# Altium schematic sheet Quilles.SchDoc
size A2
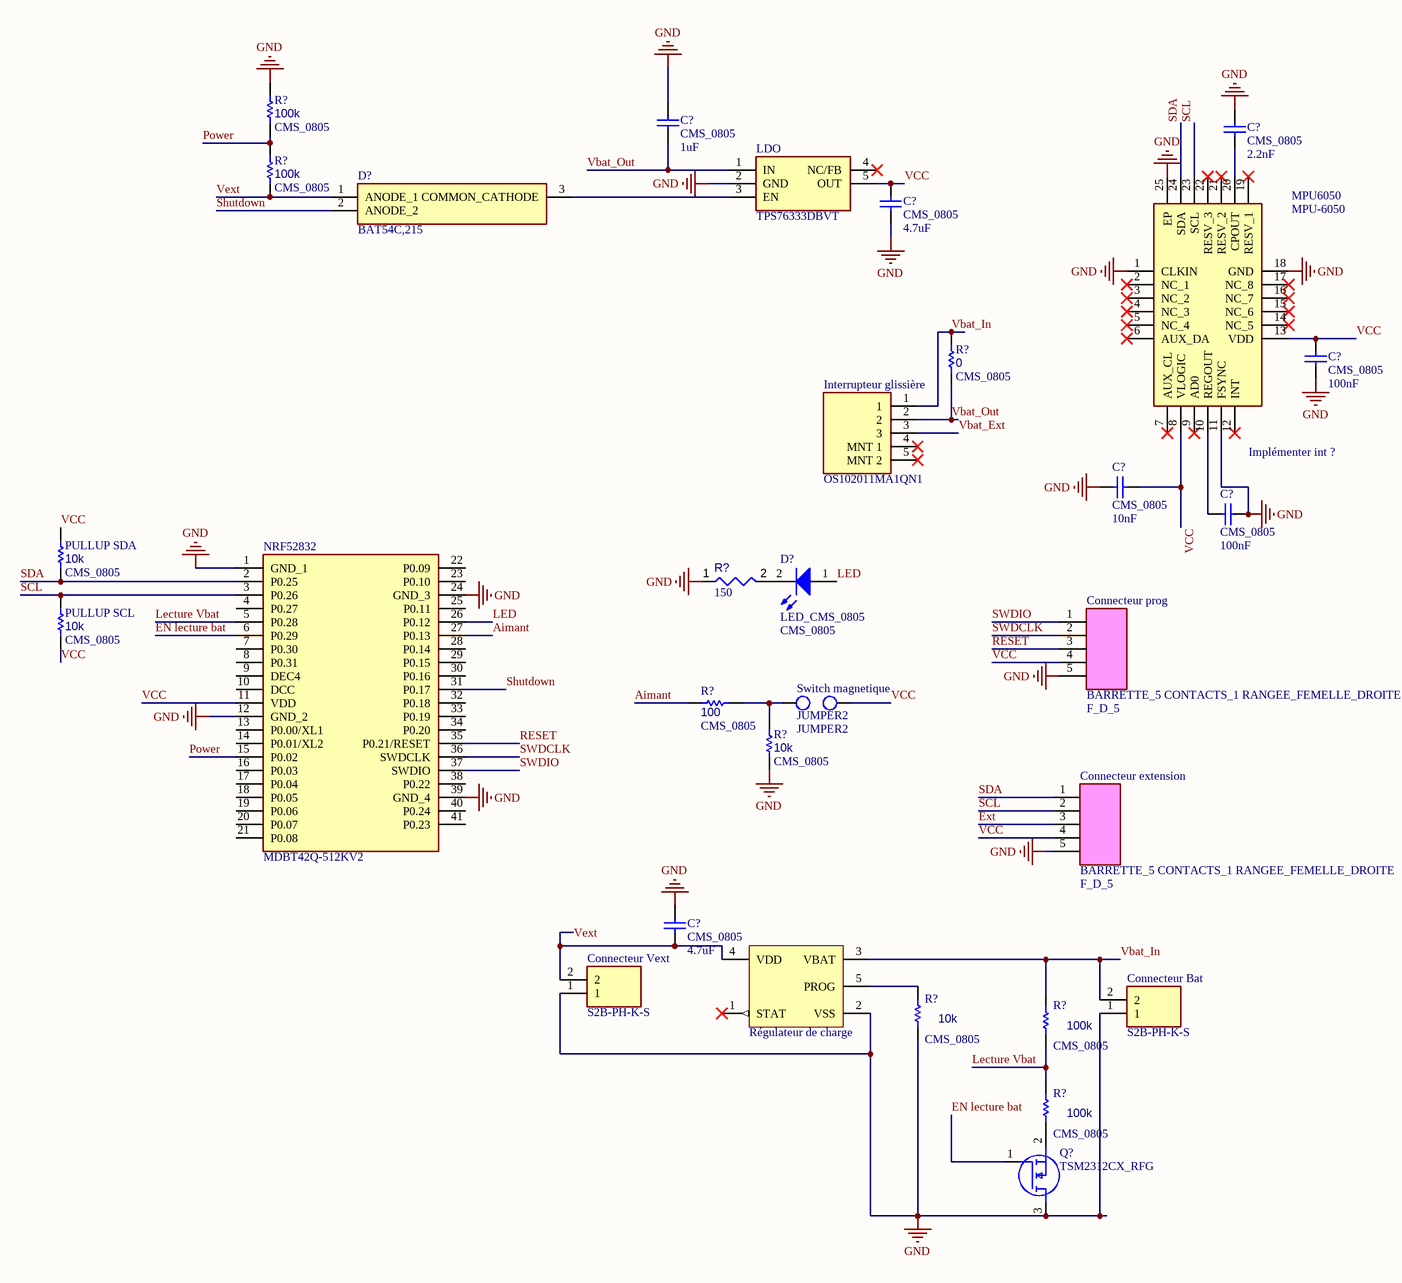
[diagram p0: Quilles.SchDoc]

## Parts
(Parts that share a designator on the sheet are numbered #1, #2 ... from top to bottom, then left to right.)
C?#1  value 1uF  Type: CMS_0805  [CONDENSATEUR_CMS_0805]  (hidden comment: CONDENSATEUR_CMS_CER_0805)
C?#2  value 2.2nF  Type: CMS_0805  [CONDENSATEUR_CMS_0805]  (hidden comment: CONDENSATEUR_CMS_CER_0805)
C?#3  value 4.7uF  Type: CMS_0805  [CONDENSATEUR_CMS_0805]  (hidden comment: CONDENSATEUR_CMS_CER_0805)
C?#4  value 100nF  Type: CMS_0805  [CONDENSATEUR_CMS_0805]  (hidden comment: CONDENSATEUR_CMS_CER_0805)
C?#5  value 10nF  Type: CMS_0805  [CONDENSATEUR_CMS_0805]  (hidden comment: CONDENSATEUR_CMS_CER_0805)
C?#6  value 100nF  Type: CMS_0805  [CONDENSATEUR_CMS_0805]  (hidden comment: CONDENSATEUR_CMS_CER_0805)
C?#7  value 4.7uF  Type: CMS_0805  [CONDENSATEUR_CMS_0805]  (hidden comment: CONDENSATEUR_CMS_CER_0805)
Connecteur_Bat  S2B-PH-K-S  [S2BPHKS]
Connecteur_extension  BARRETTE_5 CONTACTS_1 RANGEE_FEMELLE_DROITE  Type: F_D_5  [BARRETTE_5_F_D]
Connecteur_prog  BARRETTE_5 CONTACTS_1 RANGEE_FEMELLE_DROITE  Type: F_D_5  [BARRETTE_5_F_D]
Connecteur_Vext  S2B-PH-K-S  [S2BPHKS]
D?#1  BAT54C,215  [BAT54C215]
D?#2  LED_CMS_0805  Type: CMS_0805  [LED_CMS_0805]
Interrupteur_glissière  Part Number: OS102011MA1QN1  [C&K_OS102011MA1QN1_0]  (hidden comment: Switch_C&K_OS102011MA1QN1_eec)
LDO  TPS76333DBVT  [SOT95P280X145-5N]
MPU6050  MPU-6050  [MPU6050]
NRF52832  MDBT42Q-512KV2  [MDBT42Q512KV2]
PULLUP_SCL  value 10k  Type: CMS_0805  [RESISTANCE_CMS_0805]  (hidden comment: RESISTANCE_CMS_0805)
PULLUP_SDA  value 10k  Type: CMS_0805  [RESISTANCE_CMS_0805]  (hidden comment: RESISTANCE_CMS_0805)
Q?  TSM2312CX_RFG  [SOT95P280X130-3N]
R?#1  value 100k  Type: CMS_0805  [RESISTANCE_CMS_0805]  (hidden comment: RESISTANCE_CMS_0805)
R?#2  value 100k  Type: CMS_0805  [RESISTANCE_CMS_0805]  (hidden comment: RESISTANCE_CMS_0805)
R?#3  value 0  Type: CMS_0805  [RESISTANCE_CMS_0805]  (hidden comment: RESISTANCE_CMS_0805)
R?#4  value 150  [RESC0805(2012)_L]  (hidden comment: Resistor 1K +/-5% 0805 125 mW)
R?#5  value 100  Type: CMS_0805  [RESISTANCE_CMS_0805]  (hidden comment: RESISTANCE_CMS_0805)
R?#6  value 10k  Type: CMS_0805  [RESISTANCE_CMS_0805]  (hidden comment: RESISTANCE_CMS_0805)
R?#7  value 10k  Type: CMS_0805  [RESISTANCE_CMS_0805]  (hidden comment: RESISTANCE_CMS_0805)
R?#8  value 100k  Type: CMS_0805  [RESISTANCE_CMS_0805]  (hidden comment: RESISTANCE_CMS_0805)
R?#9  value 100k  Type: CMS_0805  [RESISTANCE_CMS_0805]  (hidden comment: RESISTANCE_CMS_0805)
Régulateur_de_charge  MCP73831T-2DCI/OT  [SOT-23-OT5_N]  (value not drawn)
Switch_magnetique  JUMPER2  [BARRETTE_2_M_D]

## Nets
GND: C?#1.2 C?#2.2 C?#3.1 C?#4.1 C?#5.1 C?#6.2 C?#7.2 Connecteur_Bat.1 Connecteur_extension.5 Connecteur_prog.5 Connecteur_Vext.1 LDO.2(GND) MPU6050.1(CLKIN) MPU6050.11(FSYNC) MPU6050.18(GND) MPU6050.25(EP) NRF52832.1(GND_1) NRF52832.12(GND_2) NRF52832.24(GND_3) NRF52832.39(GND_4) Q?.3(D) R?#1.2 R?#4.1 R?#6.2 R?#7.1 Régulateur_de_charge.2(VSS)
Aimant: NRF52832.27(P0.13) R?#5.1
EN lecture bat: NRF52832.6(P0.29) Q?.1(G)
Ext: Connecteur_extension.3
Lecture Vbat: NRF52832.5(P0.28) R?#8.1 R?#9.2
LED: D?#2.1 NRF52832.26(P0.12)
Power: NRF52832.15(P0.02) R?#1.1 R?#2.2
RESET: Connecteur_prog.3 NRF52832.35(P0.21/RESET)
SCL: Connecteur_extension.2 MPU6050.23(SCL) NRF52832.3(P0.26) PULLUP_SCL.2
SDA: Connecteur_extension.1 MPU6050.24(SDA) NRF52832.2(P0.25) PULLUP_SDA.1
Shutdown: D?#1.2(ANODE_2) NRF52832.31(P0.17)
SWDCLK: Connecteur_prog.2 NRF52832.36(SWDCLK)
SWDIO: Connecteur_prog.1 NRF52832.37(SWDIO)
Vbat_Ext: Interrupteur_glissière.3
Vbat_In: Connecteur_Bat.2 Interrupteur_glissière.1 R?#3.2 R?#8.2 Régulateur_de_charge.3(VBAT)
Vbat_Out: C?#1.1 Interrupteur_glissière.2 LDO.1(IN) R?#3.1
VCC: C?#3.2 C?#4.2 C?#5.2 Connecteur_extension.4 Connecteur_prog.4 LDO.5(OUT) MPU6050.8(VLOGIC) MPU6050.13(VDD) NRF52832.11(VDD) PULLUP_SCL.1 PULLUP_SDA.2 Switch_magnetique.2
Vext: C?#7.1 Connecteur_Vext.2 D?#1.1(ANODE_1) R?#2.1 Régulateur_de_charge.4(VDD)
NetC?#2_1: C?#2.1 MPU6050.20(CPOUT)
NetC?#6_1: C?#6.1 MPU6050.10(REGOUT)
NetD?#1_3: D?#1.3(COMMON_CATHODE) LDO.3(EN)
NetD?#2_2: D?#2.2 R?#4.2
NetQ?_2: Q?.2(S) R?#9.1
NetR?#5_2: R?#5.2 R?#6.1 Switch_magnetique.1
NetR?#7_2: R?#7.2 Régulateur_de_charge.5(PROG)

Not connected (* = marked no-connect by the designer): Interrupteur_glissière 4(MNT_1)* 5(MNT_2)*; LDO 4(NC/FB)*; MPU6050 2(NC_1)* 3(NC_2)* 4(NC_3)* 5(NC_4)* 6(AUX_DA)* 7(AUX_CL)* 9(AD0)* 12(INT)* 14(NC_5)* 15(NC_6)* 16(NC_7)* 17(NC_8)* 19(RESV_1)* 21(RESV_2)* 22(RESV_3)*; NRF52832 4(P0.27) 7(P0.30) 8(P0.31) 9(DEC4) 10(DCC) 13(P0.00/XL1) 14(P0.01/XL2) 16(P0.03) 17(P0.04) 18(P0.05) 19(P0.06) 20(P0.07) 21(P0.08) 22(P0.09) 23(P0.10) 25(P0.11) 28(P0.14) 29(P0.15) 30(P0.16) 32(P0.18) 33(P0.19) 34(P0.20) 38(P0.22) 40(P0.24) 41(P0.23); Régulateur_de_charge 1(STAT)*

## Notes on the sheet
- Implémenter int ?

## Library data of the parts
C?#1-C?#7 = CMP-038-0003-1: CONDENSATEUR CMS CERAMIQUE 0805; Source: composants passifs.SchLib; Design Item ID: CONDENSATEUR_CMS_CER_0805
Connecteur_Bat Connecteur_Vext = S2B-PH-K-S: Connector; Manufacturer_Name: JST (JAPAN SOLDERLESS TERMINALS); Datasheet Link: https://media.digikey.com/pdf/Data%20Sheets/JST%20PDFs/PH%20Series.pdf; Height: 4.8mm; Manufacturer_Part_Number: S2B-PH-K-S
Connecteur_extension Connecteur_prog = CMP-039-0118-1: BARRETTE 5 CONTACTS 1 RANGEE FEMELLE DROITE; Design Item ID: BARRETTE_5 CONTACTS_1 RANGEE_FEMELLE_DROITE; Source: connecteurs.SchLib
D?#1 = BAT54C,215: Schottky Diode; Manufacturer_Name: Nexperia; Datasheet Link: https://assets.nexperia.com/documents/data-sheet/BAT54_SER.pdf; Height: 1.1mm; Manufacturer_Part_Number: BAT54C,215; Mouser Part Number: 771-BAT54C-T/R; Mouser Price/Stock: https://www.mouser.co.uk/ProductDetail/Nexperia/BAT54C215?qs=me8TqzrmIYV5SKKt13YKQA%3D%3D; Arrow Part Number: BAT54C,215; Arrow Price/Stock: https://www.arrow.com/en/products/bat54c215/nexperia?region=nac
D?#2 = CMP-024-0003-1: LED CMS 0805; Source: affichage.SchLib; Design Item ID: LED_CMS_0805
Interrupteur_glissière = Switch_C&K_OS102011MA1QN1_eec: SWITCH SLIDE SPDT 100MA 12V; Manufacturer: C&K; helpURL: https://upverter.com/upn/revision/2b2ed0fd4d150582/; ComponentLink2Description: Datasheet; Temperature: -30°C to +70°C; Package: SW_SLIDE; Supplier 2: Mouser; Price: 0.290275964971; Supplier 1: Digi-Key; ComponentLink1URL: https://upverter.com/upn/revision/2b2ed0fd4d150582/; Supplier Part Number 2: OS102011MA1QN1; Supplier Part Number 1: CKN9559-ND; ComponentLink1Description: Upverter; ComponentLink2URL: https://www.ckswitches.com/media/1428/os.pdf; RoHS: TRUE; Mouser Part Number: OS102011MA1QN1; Temperature Range High: +70°C; Digikey Description: SWITCH SLIDE SPDT 100MA 12V; Digikey Part Number: CKN9559-ND; Lead Free: yes; Temperature Range Low: -30°C
LDO = TPS76333DBVT: Integrated Circuit; Manufacturer_Name: Texas Instruments; Datasheet Link: https://datasheet.datasheetarchive.com/originals/distributors/Datasheets-36/DSA-717371.pdf; Height: 1.45mm; Manufacturer_Part_Number: TPS76333DBVT; Mouser Part Number: 595-TPS76333DBVT; Mouser Price/Stock: https://www.mouser.co.uk/ProductDetail/Texas-Instruments/TPS76333DBVT?qs=tJ5HNKWh3OU6kt%2FvF%2F5hDQ%3D%3D; Arrow Part Number: TPS76333DBVT; Arrow Price/Stock: https://www.arrow.com/en/products/tps76333dbvt/texas-instruments?region=nac
MPU6050 = MPU-6050: Integrated Circuit; Manufacturer_Name: TDK; Datasheet Link: https://product.tdk.com/system/files/dam/doc/product/sensor/mortion-inertial/imu/data_sheet/mpu-6000-datasheet1.pdf; Height: 0.95mm; Manufacturer_Part_Number: MPU-6050; Mouser Part Number: 410-MPU-6050; Mouser Price/Stock: https://www.mouser.co.uk/ProductDetail/TDK-InvenSense/MPU-6050?qs=u4fy%2FsgLU9O14B5JgyQFvg%3D%3D; Arrow Part Number: MPU-6050; Arrow Price/Stock: https://www.arrow.com/en/products/mpu-6050/invensense?region=nac
NRF52832 = MDBT42Q-512KV2: Integrated Circuit; Manufacturer_Name: Raytac; Datasheet Link: http://www.raytac.com/download/index.php?index_id=27; Height: 2.2mm; Manufacturer_Part_Number: MDBT42Q-512KV2
PULLUP_SCL PULLUP_SDA R?#1-R?#3 R?#5-R?#9 = CMP-037-0001-1: RESISTANCE CMS 0805; Design Item ID: RESISTANCE_CMS_0805; Source: composants passifs.SchLib
Q? = TSM2312CX_RFG: MOSFET (N-Channel); Manufacturer_Name: Taiwan Semiconductor; Manufacturer_Part_Number: TSM2312CX RFG; Datasheet Link: https://datasheet.datasheetarchive.com/originals/distributors/DKDS-20/389616.pdf; Height: 1.3mm; Mouser Part Number: 821-TSM2312CXRFG; Mouser Price/Stock: https://www.mouser.co.uk/ProductDetail/Taiwan-Semiconductor/TSM2312CX-RFG?qs=QEzMiVqgwc0lDLiJAqaF%252Bw%3D%3D; Arrow Part Number: TSM2312CX RFG; Arrow Price/Stock: https://www.arrow.com/en/products/tsm2312cxrfg/taiwan-semiconductor?region=asia
R?#4 = CMP-009-00118-3: Chip Resistor, 1 kOhms, +/-5%, 125 mW, -55 to 155 degC, 0805; Tolerance: 5%; Power: 125mW; Case/Package: 0805; Pins: 2; Min Operating Temperature: -55°C; Max Operating Temperature: 155°C
Régulateur_de_charge = CMP-045-0000-1: Miniature Single-Cell, Fully Integrated Li-Ion, Li-Polymer Charge Management Controller, 4.2V, 5-Pin SOT-23, Industrial Temperature, Tape and Reel; Manufacturer: Microchip; PackageReference: SOT-23-OT5; Code_IPC: SOT23-5; Source: energie.SchLib; PartNumber: MCP73831T-2DCI/OT; PackageVersion: revBB, Aug-2009; Design Item ID: MCP73831T-2DCI/OT; Mounting Technology: Surface Mount; PackageDescription: 5-Lead Plastic Small Outline Transistor (OT) [SOT-23]; ComponentLink1URL: http://www.microchip.com/; ComponentLink1Description: Manufacturer URL; ComponentLink3Description: Package Specification; ComponentLink2Description: Datasheet; DatasheetVersion: revE, Sep-2008; ComponentLink2URL: http://ww1.microchip.com/downloads/en/DeviceDoc/21984e.pdf; ComponentLink3URL: http://www.microchip.com/stellent/groups/techpub_sg/documents/packagingspec/en012702.pdf
Switch_magnetique = CMP-039-0004-1: BARRETTE 2 CONTACTS 1 RANGEE MALE DROITE; Type: JUMPER2; Design Item ID: JUMPER2; Source: connecteurs.SchLib